# Altium schematic sheet Module Board.SchDoc: Module Board
size A3; Author: Arjan Blankestijn; Revision: V1; SheetNumber: 1; SheetTotal: 3; Team: 2024; Subsystem: Module Board; ProjectPrettyName: BMS
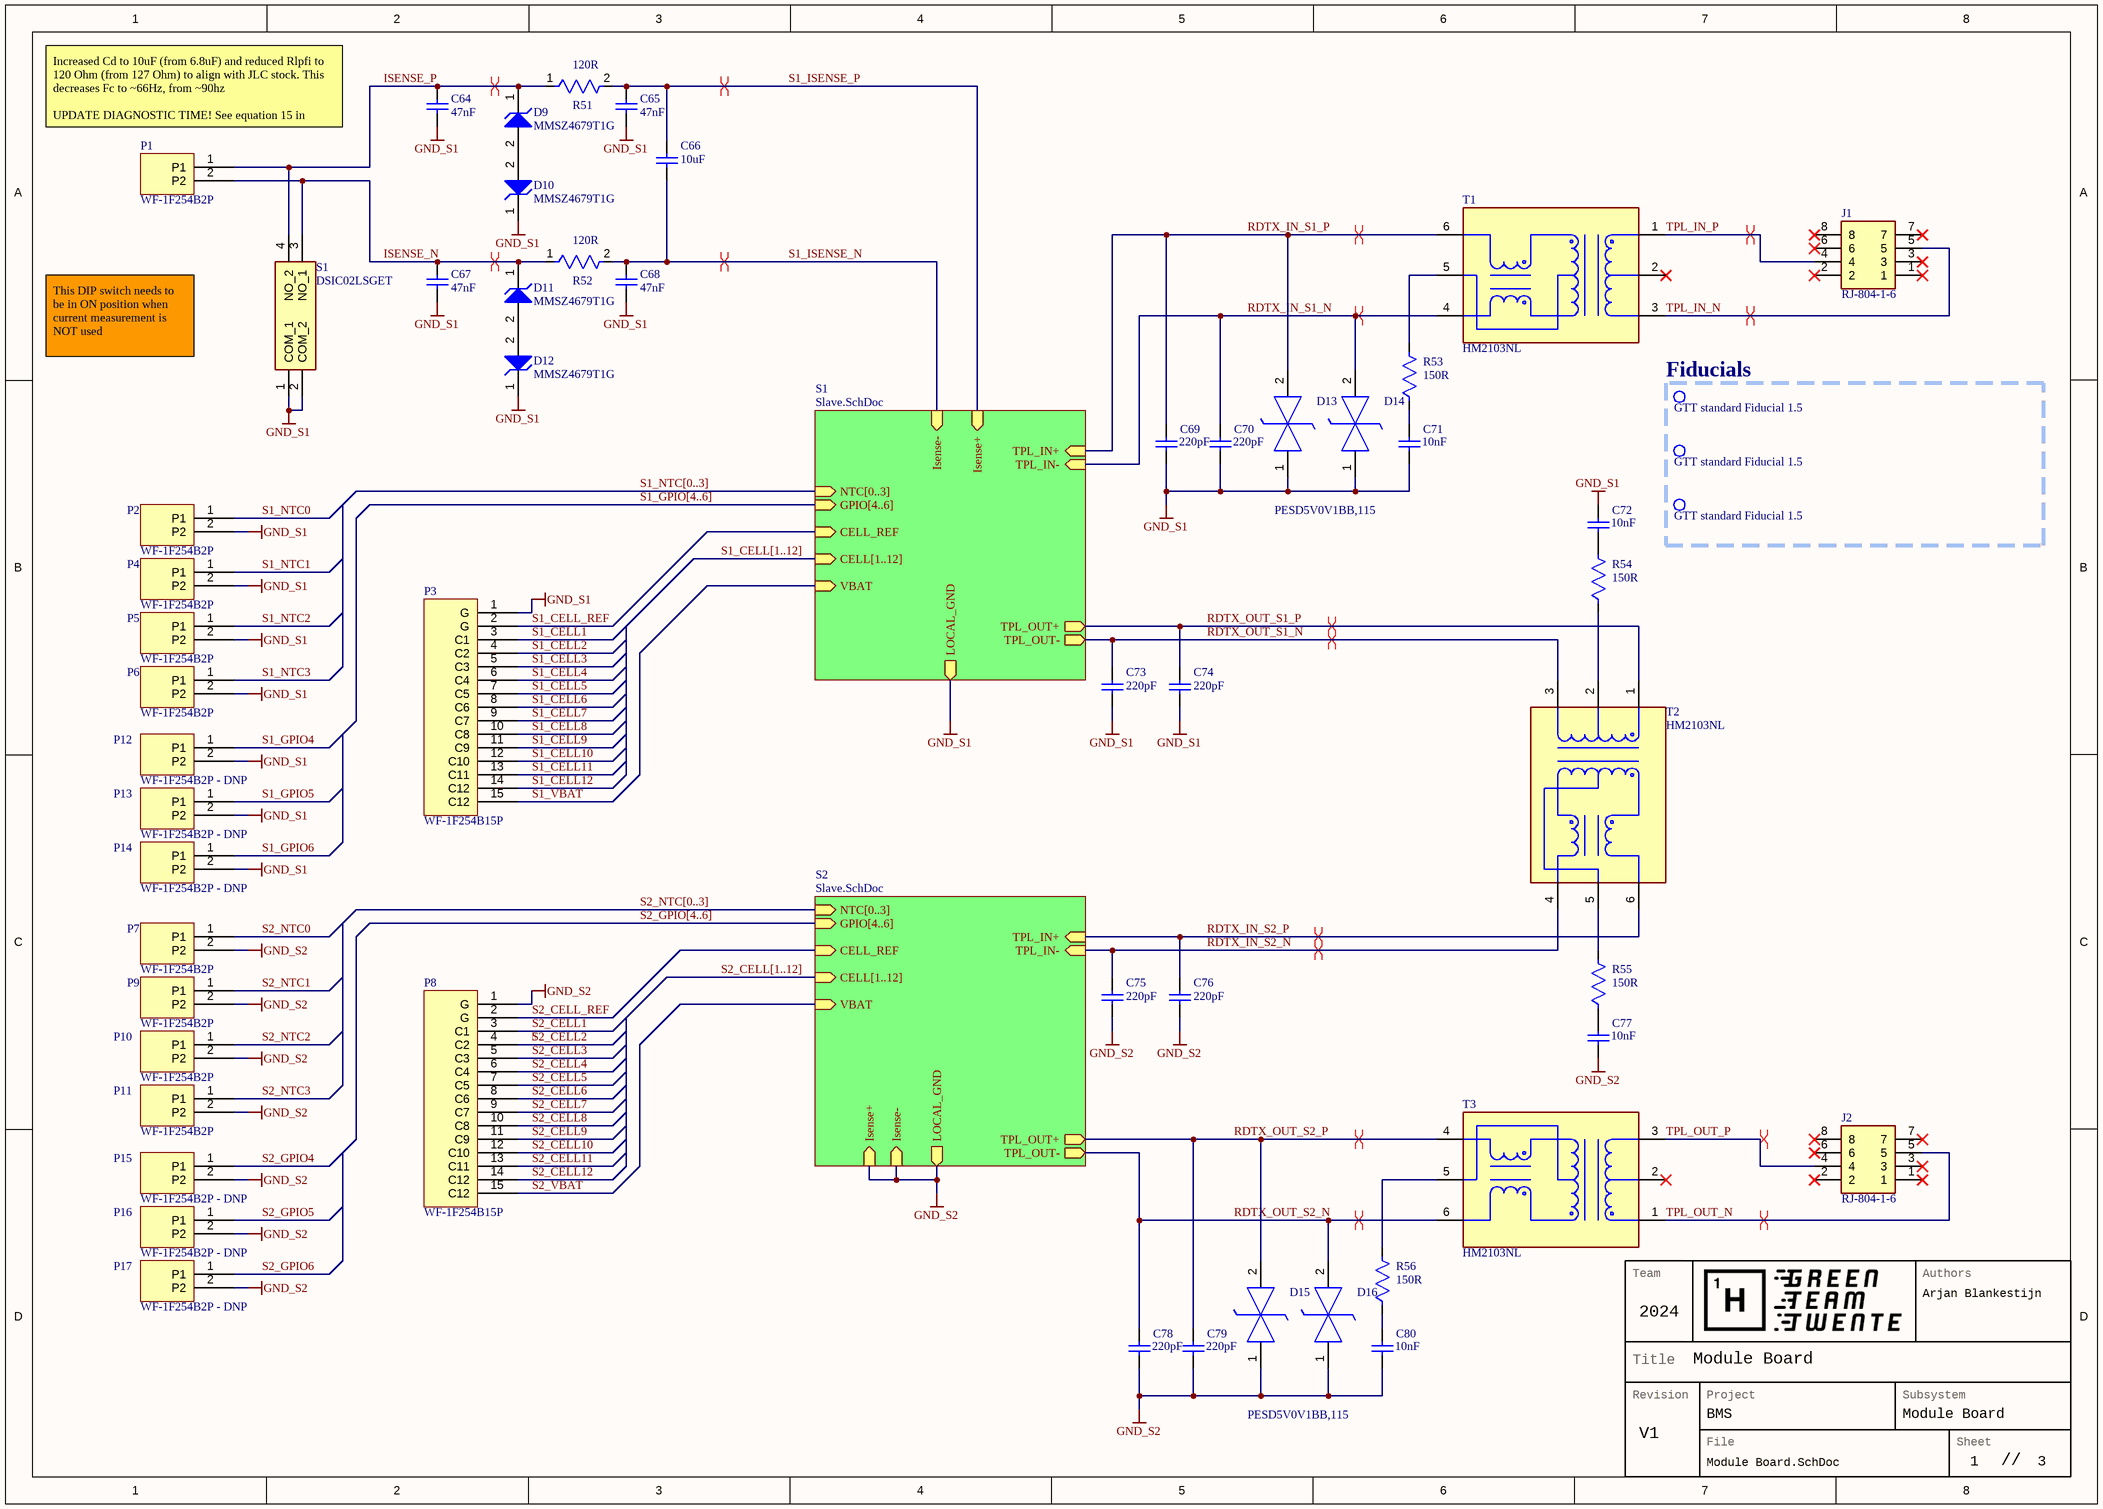
[diagram p0: Module Board.SchDoc]

## Parts
*1  GTT standard Fiducial 1.5  [Fiducial 1.5mm]  (no BOM)
*3  GTT standard Fiducial 1.5  [Fiducial 1.5mm]  (no BOM)
*5  GTT standard Fiducial 1.5  [Fiducial 1.5mm]  (no BOM)
C64  value 47nF  [WCAP-CSGP_0603_L1.6W0.8H0.8_Reflow]  (hidden comment: CAP 0603 47nF X7R)
C65  value 47nF  [WCAP-CSGP_0603_L1.6W0.8H0.8_Reflow]  (hidden comment: CAP 0603 47nF X7R)
C66  value 10uF  [WCAP-CSGP_0805_L2W1.25H0.6_Reflow]  (hidden comment: CAP 0805 10uF X7R)
C67  value 47nF  [WCAP-CSGP_0603_L1.6W0.8H0.8_Reflow]  (hidden comment: CAP 0603 47nF X7R)
C68  value 47nF  [WCAP-CSGP_0603_L1.6W0.8H0.8_Reflow]  (hidden comment: CAP 0603 47nF X7R)
C69  value 220pF  [WCAP-CSGP_0402_L1W0.5H0.5]  (hidden comment: CAP 0402 220pF X7R)
C70  value 220pF  [WCAP-CSGP_0402_L1W0.5H0.5]  (hidden comment: CAP 0402 220pF X7R)
C71  value 10nF  [WCAP-CSGP_0402_L1W0.5H0.5]  (hidden comment: CAP 0402 10nF X7R)
C72  value 10nF  [WCAP-CSGP_0402_L1W0.5H0.5]  (hidden comment: CAP 0402 10nF X7R)
C73  value 220pF  [WCAP-CSGP_0402_L1W0.5H0.5]  (hidden comment: CAP 0402 220pF X7R)
C74  value 220pF  [WCAP-CSGP_0402_L1W0.5H0.5]  (hidden comment: CAP 0402 220pF X7R)
C75  value 220pF  [WCAP-CSGP_0402_L1W0.5H0.5]  (hidden comment: CAP 0402 220pF X7R)
C76  value 220pF  [WCAP-CSGP_0402_L1W0.5H0.5]  (hidden comment: CAP 0402 220pF X7R)
C77  value 10nF  [WCAP-CSGP_0402_L1W0.5H0.5]  (hidden comment: CAP 0402 10nF X7R)
C78  value 220pF  [WCAP-CSGP_0402_L1W0.5H0.5]  (hidden comment: CAP 0402 220pF X7R)
C79  value 220pF  [WCAP-CSGP_0402_L1W0.5H0.5]  (hidden comment: CAP 0402 220pF X7R)
C80  value 10nF  [WCAP-CSGP_0402_L1W0.5H0.5]  (hidden comment: CAP 0402 10nF X7R)
D9  MMSZ4679T1G  [ONSC-SOD-123-2-425-04_V]
D10  MMSZ4679T1G  [ONSC-SOD-123-2-425-04_V]
D11  MMSZ4679T1G  [ONSC-SOD-123-2-425-04_V]
D12  MMSZ4679T1G  [ONSC-SOD-123-2-425-04_V]
D13  PESD5V0V1BB,115  [PESD5V0V1BB115]  (value not drawn)
D14  PESD5V0V1BB,115  [PESD5V0V1BB115]
D15  PESD5V0V1BB,115  [PESD5V0V1BB115]  (value not drawn)
D16  PESD5V0V1BB,115  [PESD5V0V1BB115]
J1  RJ-804-1-6  [RJ80416]
J2  RJ-804-1-6  [RJ80416]
P1  WF-1F254B2P  [WF-1F254B2P]
P2  WF-1F254B2P  [WF-1F254B2P]
P3  WF-1F254B15P  [WF-1F254B15P]
P4  WF-1F254B2P  [WF-1F254B2P]
P5  WF-1F254B2P  [WF-1F254B2P]
P6  WF-1F254B2P  [WF-1F254B2P]
P7  WF-1F254B2P  [WF-1F254B2P]
P8  WF-1F254B15P  [WF-1F254B15P]
P9  WF-1F254B2P  [WF-1F254B2P]
P10  WF-1F254B2P  [WF-1F254B2P]
P11  WF-1F254B2P  [WF-1F254B2P]
P12  WF-1F254B2P - DNP  [WF-1F254B2P]  (no BOM)
P13  WF-1F254B2P - DNP  [WF-1F254B2P]  (no BOM)
P14  WF-1F254B2P - DNP  [WF-1F254B2P]  (no BOM)
P15  WF-1F254B2P - DNP  [WF-1F254B2P]  (no BOM)
P16  WF-1F254B2P - DNP  [WF-1F254B2P]  (no BOM)
P17  WF-1F254B2P - DNP  [WF-1F254B2P]  (no BOM)
R51  value 120R  [FP0402]  (hidden comment: RES 0402 120R 1%)
R52  value 120R  [FP0402]  (hidden comment: RES 0402 120R 1%)
R53  value 150R  [RES_SM0603_YAGEORC_N]  (hidden comment: RES 0603 150R 1%)
R54  value 150R  [RES_SM0603_YAGEORC_N]  (hidden comment: RES 0603 150R 1%)
R55  value 150R  [RES_SM0603_YAGEORC_N]  (hidden comment: RES 0603 150R 1%)
R56  value 150R  [RES_SM0603_YAGEORC_N]  (hidden comment: RES 0603 150R 1%)
S1  DSIC02LSGET  [SOP254P930X445-4N]
T1  HM2103NL  [FP-HM2103NL-MFG]
T2  HM2103NL  [FP-HM2103NL-MFG]
T3  HM2103NL  [FP-HM2103NL-MFG]

## Blocks framed on the sheet
Fiducials: *1 *3 *5

## Sub-sheets
S1 = Slave.SchDoc: LOCAL_GND (out), NTC[0..3] (in), TPL_IN+ (in), TPL_IN- (in), TPL_OUT+ (out), TPL_OUT- (out), Isense+ (in), Isense- (in), CELL[1..12] (in), CELL_REF (in), VBAT (in), GPIO[4..6] (in)
S2 = Slave.SchDoc: LOCAL_GND (out), NTC[0..3] (in), TPL_IN+ (in), TPL_IN- (in), TPL_OUT+ (out), TPL_OUT- (out), Isense+ (in), Isense- (in), CELL[1..12] (in), CELL_REF (in), VBAT (in), GPIO[4..6] (in)

## Nets
GND_S1: C64.1 C65.1 C67.1 C68.1 C69.1 C70.1 C71.1 C72.2 C73.1 C74.2 D10.1(K) D12.1(K) D13.1(K1) D14.1(K1) P2.2(P2) P3.1(G) P4.2(P2) P5.2(P2) P6.2(P2) P12.2(P2) P13.2(P2) P14.2(P2) S1.1(COM_1) S1.2(COM_2) ; sheet S1/LOCAL_GND
GND_S2: C75.1 C76.1 C77.1 C78.1 C79.1 C80.1 D15.1(K1) D16.1(K1) P7.2(P2) P8.1(G) P9.2(P2) P10.2(P2) P11.2(P2) P15.2(P2) P16.2(P2) P17.2(P2) ; sheet S2/LOCAL_GND, sheet S2/Isense+, sheet S2/Isense-
: P8.4(C2)  [also labelled S2_CELL2]
ISENSE_N: C67.2 D11.1(K) P1.2(P2) R52.1 S1.3(NO_1)
ISENSE_P: C64.2 D9.1(K) P1.1(P1) R51.1 S1.4(NO_2)
RDTX_IN_S1_N: C70.2 D14.2(K2) T1.4 ; sheet S1/TPL_IN-
RDTX_IN_S1_P: C69.2 D13.2(K2) T1.6 ; sheet S1/TPL_IN+
RDTX_IN_S2_N: C75.2 T2.4 ; sheet S2/TPL_IN-
RDTX_IN_S2_P: C76.2 T2.6 ; sheet S2/TPL_IN+
RDTX_OUT_S1_N: C73.2 T2.3 ; sheet S1/TPL_OUT-
RDTX_OUT_S1_P: C74.1 T2.1 ; sheet S1/TPL_OUT+
RDTX_OUT_S2_N: C78.2 D16.2(K2) T3.6 ; sheet S2/TPL_OUT-
RDTX_OUT_S2_P: C79.2 D15.2(K2) T3.4 ; sheet S2/TPL_OUT+
S1_CELL1: P3.3(C1)
S1_CELL2: P3.4(C2)
S1_CELL3: P3.5(C3)
S1_CELL4: P3.6(C4)
S1_CELL5: P3.7(C5)
S1_CELL6: P3.8(C6)
S1_CELL7: P3.9(C7)
S1_CELL8: P3.10(C8)
S1_CELL9: P3.11(C9)
S1_CELL10: P3.12(C10)
S1_CELL11: P3.13(C11)
S1_CELL12: P3.14(C12)
S1_CELL_REF: P3.2(G) ; sheet S1/CELL_REF
S1_GPIO4: P12.1(P1)
S1_GPIO5: P13.1(P1)
S1_GPIO6: P14.1(P1)
S1_ISENSE_N: C66.1 C68.2 R52.2 ; sheet S1/Isense-
S1_ISENSE_P: C65.2 C66.2 R51.2 ; sheet S1/Isense+
S1_NTC0: P2.1(P1)
S1_NTC1: P4.1(P1)
S1_NTC2: P5.1(P1)
S1_NTC3: P6.1(P1)
S1_VBAT: P3.15(C12) ; sheet S1/VBAT
S2_CELL1: P8.3(C1)
S2_CELL3: P8.5(C3)
S2_CELL4: P8.6(C4)
S2_CELL5: P8.7(C5)
S2_CELL6: P8.8(C6)
S2_CELL7: P8.9(C7)
S2_CELL8: P8.10(C8)
S2_CELL9: P8.11(C9)
S2_CELL10: P8.12(C10)
S2_CELL11: P8.13(C11)
S2_CELL12: P8.14(C12)
S2_CELL_REF: P8.2(G) ; sheet S2/CELL_REF
S2_GPIO4: P15.1(P1)
S2_GPIO5: P16.1(P1)
S2_GPIO6: P17.1(P1)
S2_NTC0: P7.1(P1)
S2_NTC1: P9.1(P1)
S2_NTC2: P10.1(P1)
S2_NTC3: P11.1(P1)
S2_VBAT: P8.15(C12) ; sheet S2/VBAT
TPL_IN_N: J1.5 T1.3
TPL_IN_P: J1.4 T1.1
TPL_OUT_N: J2.5 T3.1
TPL_OUT_P: J2.4 T3.3
NetC71_2: C71.2 R53.1
NetC72_1: C72.1 R54.2
NetC77_2: C77.2 R55.1
NetC80_2: C80.2 R56.1
NetD9_2: D9.2(A) D10.2(A)
NetD11_2: D11.2(A) D12.2(A)
NetR53_2: R53.2 T1.5
NetR54_1: R54.1 T2.2
NetR55_2: R55.2 T2.5
NetR56_2: R56.2 T3.5

Not connected (* = marked no-connect by the designer): J1 1* 2* 3* 6* 7* 8*; J2 1* 2* 3* 6* 7* 8*; T1 2*; T3 2*

## Buses and harness runs
bus S1_CELL[1..12] = sheet S1/CELL[1..12]
bus S1_GPIO[4..6] = sheet S1/GPIO[4..6]
bus S1_NTC[0..3] = sheet S1/NTC[0..3]
bus S2_CELL[1..12] = sheet S2/CELL[1..12]
bus S2_GPIO[4..6] = sheet S2/GPIO[4..6]
bus S2_NTC[0..3] = sheet S2/NTC[0..3]

## Layout directives
differential pair; differential pair class TPL100; rule Clearance Constraint [Generic clearance = 0.15mm, and 12 value(s) for objects]: RDTX_IN_S1_N, RDTX_IN_S1_P, RDTX_IN_S2_N, RDTX_IN_S2_P, RDTX_OUT_S1_N, RDTX_OUT_S1_P, RDTX_OUT_S2_N, RDTX_OUT_S2_P, TPL_IN_N, TPL_IN_P, TPL_OUT_N, TPL_OUT_P
differential pair: ISENSE_N, ISENSE_P, S1_ISENSE_N, S1_ISENSE_P

## Notes on the sheet
- (near P1) Increased Cd to 10uF (from 6.8uF) and reduced Rlpfi to 120 Ohm (from 127 Ohm) to align with JLC stock. This decreases Fc to ~66Hz, from ~90hz
  UPDATE DIAGNOSTIC TIME! See equation 15 in datasheet
- This DIP switch needs to be in ON position when current measurement is NOT used
- Team
- Authors
- Revision
- Title
- Project
- Subsystem
- File
- Sheet
- //

## Library data of the parts
*1 *3 *5 = CMP-00028-00005-4: Fiducial 1.5; Pins: 0
C64 C65 C67 C68 = CMP-001-01309-1: GTT Standard 0603 non-polarized capacitor; Voltage Rating: 100V; Tolerance: 5%; Case/Package: 0603; Category: Multilayer Ceramic Chip Capacitors; Ceramic Type: X7R; Pins: 2; JLCPCB Part #: C1622
C66 = CMP-001-01310-1: GTT Standard 0805 non-polarized capacitor; Case/Package: 0805; Category: Multilayer Ceramic Chip Capacitors; Pins: 2; Ceramic Type: X7R; JLCPCB Part #: C440198
C69-C80 = CMP-001-01308-5: GTT Standard 0402 non-polarized capacitor; Pins: 2; Case/Package: 0402; Category: Multilayer Ceramic Chip Capacitors; Ceramic Type: X7R
  C69 C70 C73-C76 C78 C79: JLCPCB Part #: C1530
  C71 C72 C77 C80: JLCPCB Part #: C15195
D9-D12 = CMP-1060-00509-1: Zener Voltage Regulator, 500 mW, 2-Pin SOD-123, Pb-Free, Tape and Reel; Manufacturer: On Semiconductor; P Max (W): 0.5; VZ Typ (V): 2; Packing: Tape and Reel; ComponentLink1Description: Manufacturer URL; DatasheetVersion: Rev. 9; PackageReference: SOD-123-2-425-04; ComponentLink3URL: http://www.onsemi.com/pub_link/Collateral/425-04.PDF; PackageDescription: 2-Pin SOD, Body 1.6 x 2.69 mm; ComponentLink3Description: Package Specification; ComponentLink2Description: Datasheet; ComponentLink1URL: http://www.onsemi.com/; PartNumber: MMSZ4679T1G; RoHS: Pb-Free; PackageVersion: Rev. G, 10/2009; ComponentLink2URL: http://www.onsemi.com/pub_link/Collateral/MMSZ4678T1-D.PDF; Mounting Technology: Surface Mount
D13-D16 = CMP-004-00097-1: PESD5V0V1BB - Very low capacitance bidirectional ESD protection diode; Manufacturer_Name: Nexperia; Arrow Price/Stock: https://www.arrow.com/en/products/pesd5v0v1bb115/nexperia?region=nac; Design Item ID: PESD5V0V1BB,115; Height: 0.65mm; Manufacturer_Part_Number: PESD5V0V1BB,115; Mouser Price/Stock: https://www.mouser.co.uk/ProductDetail/Nexperia/PESD5V0V1BB115?qs=GcY6OjH1zdkfLKV5vNnV%252BA%3D%3D; Datasheet Link: https://assets.nexperia.com/documents/data-sheet/PESD5V0V1BB.pdf; Mouser Part Number: 771-PESD5V0V1BB115; Source: TempSchematics.schlib; Arrow Part Number: PESD5V0V1BB,115
J1 J2 = RJ-804-1-6: Connector; Manufacturer_Name: FG; Datasheet Link: https://www.lcsc.com/datasheet/lcsc_datasheet_2306211558_FG-RJ-804-1-6_C7205183.pdf; Height: 11.7mm; Manufacturer_Part_Number: RJ-804-1-6
P1 P2 P4-P7 P9-P17 = WF-1F254B2P: 2-pins JST XHB connector SMD right-angle
P3 P8 = WF-1F254B15P: 15-pins JST XHB connector SMD right-angle; Pin count: 15
R51 R52 = CMP-009-00204-16: GTT Standard 0402 Resistor; Voltage Rating: 50V; Power: 62.5mW; Case/Package: 0402; Mounting Technology: SMD; Design Item ID: RES 0402; Source: Passives.SchLib; Tolerance: 1%; JLCPCB Part #: C25079
R53-R56 = CMP-009-00206-3: GTT Standard 0603 Resistor; Power: 62.5mW; Voltage Rating: 50V; Tolerance: 1%; Mounting Technology: SMD; Case/Package: 0603; JLCPCB Part #: C22808
S1 = DSIC02LSGET: Switch; Manufacturer_Name: Dongguan Guangzhu Industrial; Datasheet Link: https://datasheet.lcsc.com/szlcsc/Dongguan-Guangzhu-Industrial-DSIC02LSGET_C54949.pdf; Height: 4.45mm; Manufacturer_Part_Number: DSIC02LSGET
T1-T3 = CMP-16309-000039-1: XFMR CMC MODULE AECQ BATT MNGT; Obsolete Part: false; Manufacturer: Pulse; Isolation Voltage: 4300VDC; Automotive Grade: Grade 1; Turns Ratio: 1:1; Standoff Height: 0.13mm; Insertion Loss: 0.25dB; Return Loss: 20dB; Inductance Primary: 150uH; Device Class L2: Transformers; Automotive: Yes; RoHS: TRUE; Device Class L1: Passive Components; Digikey Description: XFMR CMC MODULE AECQ BATT MNGT; Package: 0; Manufacturer Part Number: HM2103NL; Height: 5.72mm; Temperature Range High: +125°C; Temperature Range Low: -40°C; Category: Trans; Temperature: -40°C to +125°C; Lead Free: Yes; ComponentLink2URL: https://productfinder.pulseeng.com/product/HM2103NL; Octopart: https://octopart.com/hm2103nl-pulse-87646222; Device Class L3: unset; ComponentLink2Description: Datasheet; JLCPCB Part #: C962543